# Altium schematic sheet 1_INDEX.SchDoc
size 420 x 297 mm; SheetNumber: 1; SheetTotal: 7; Sub-system: LDA
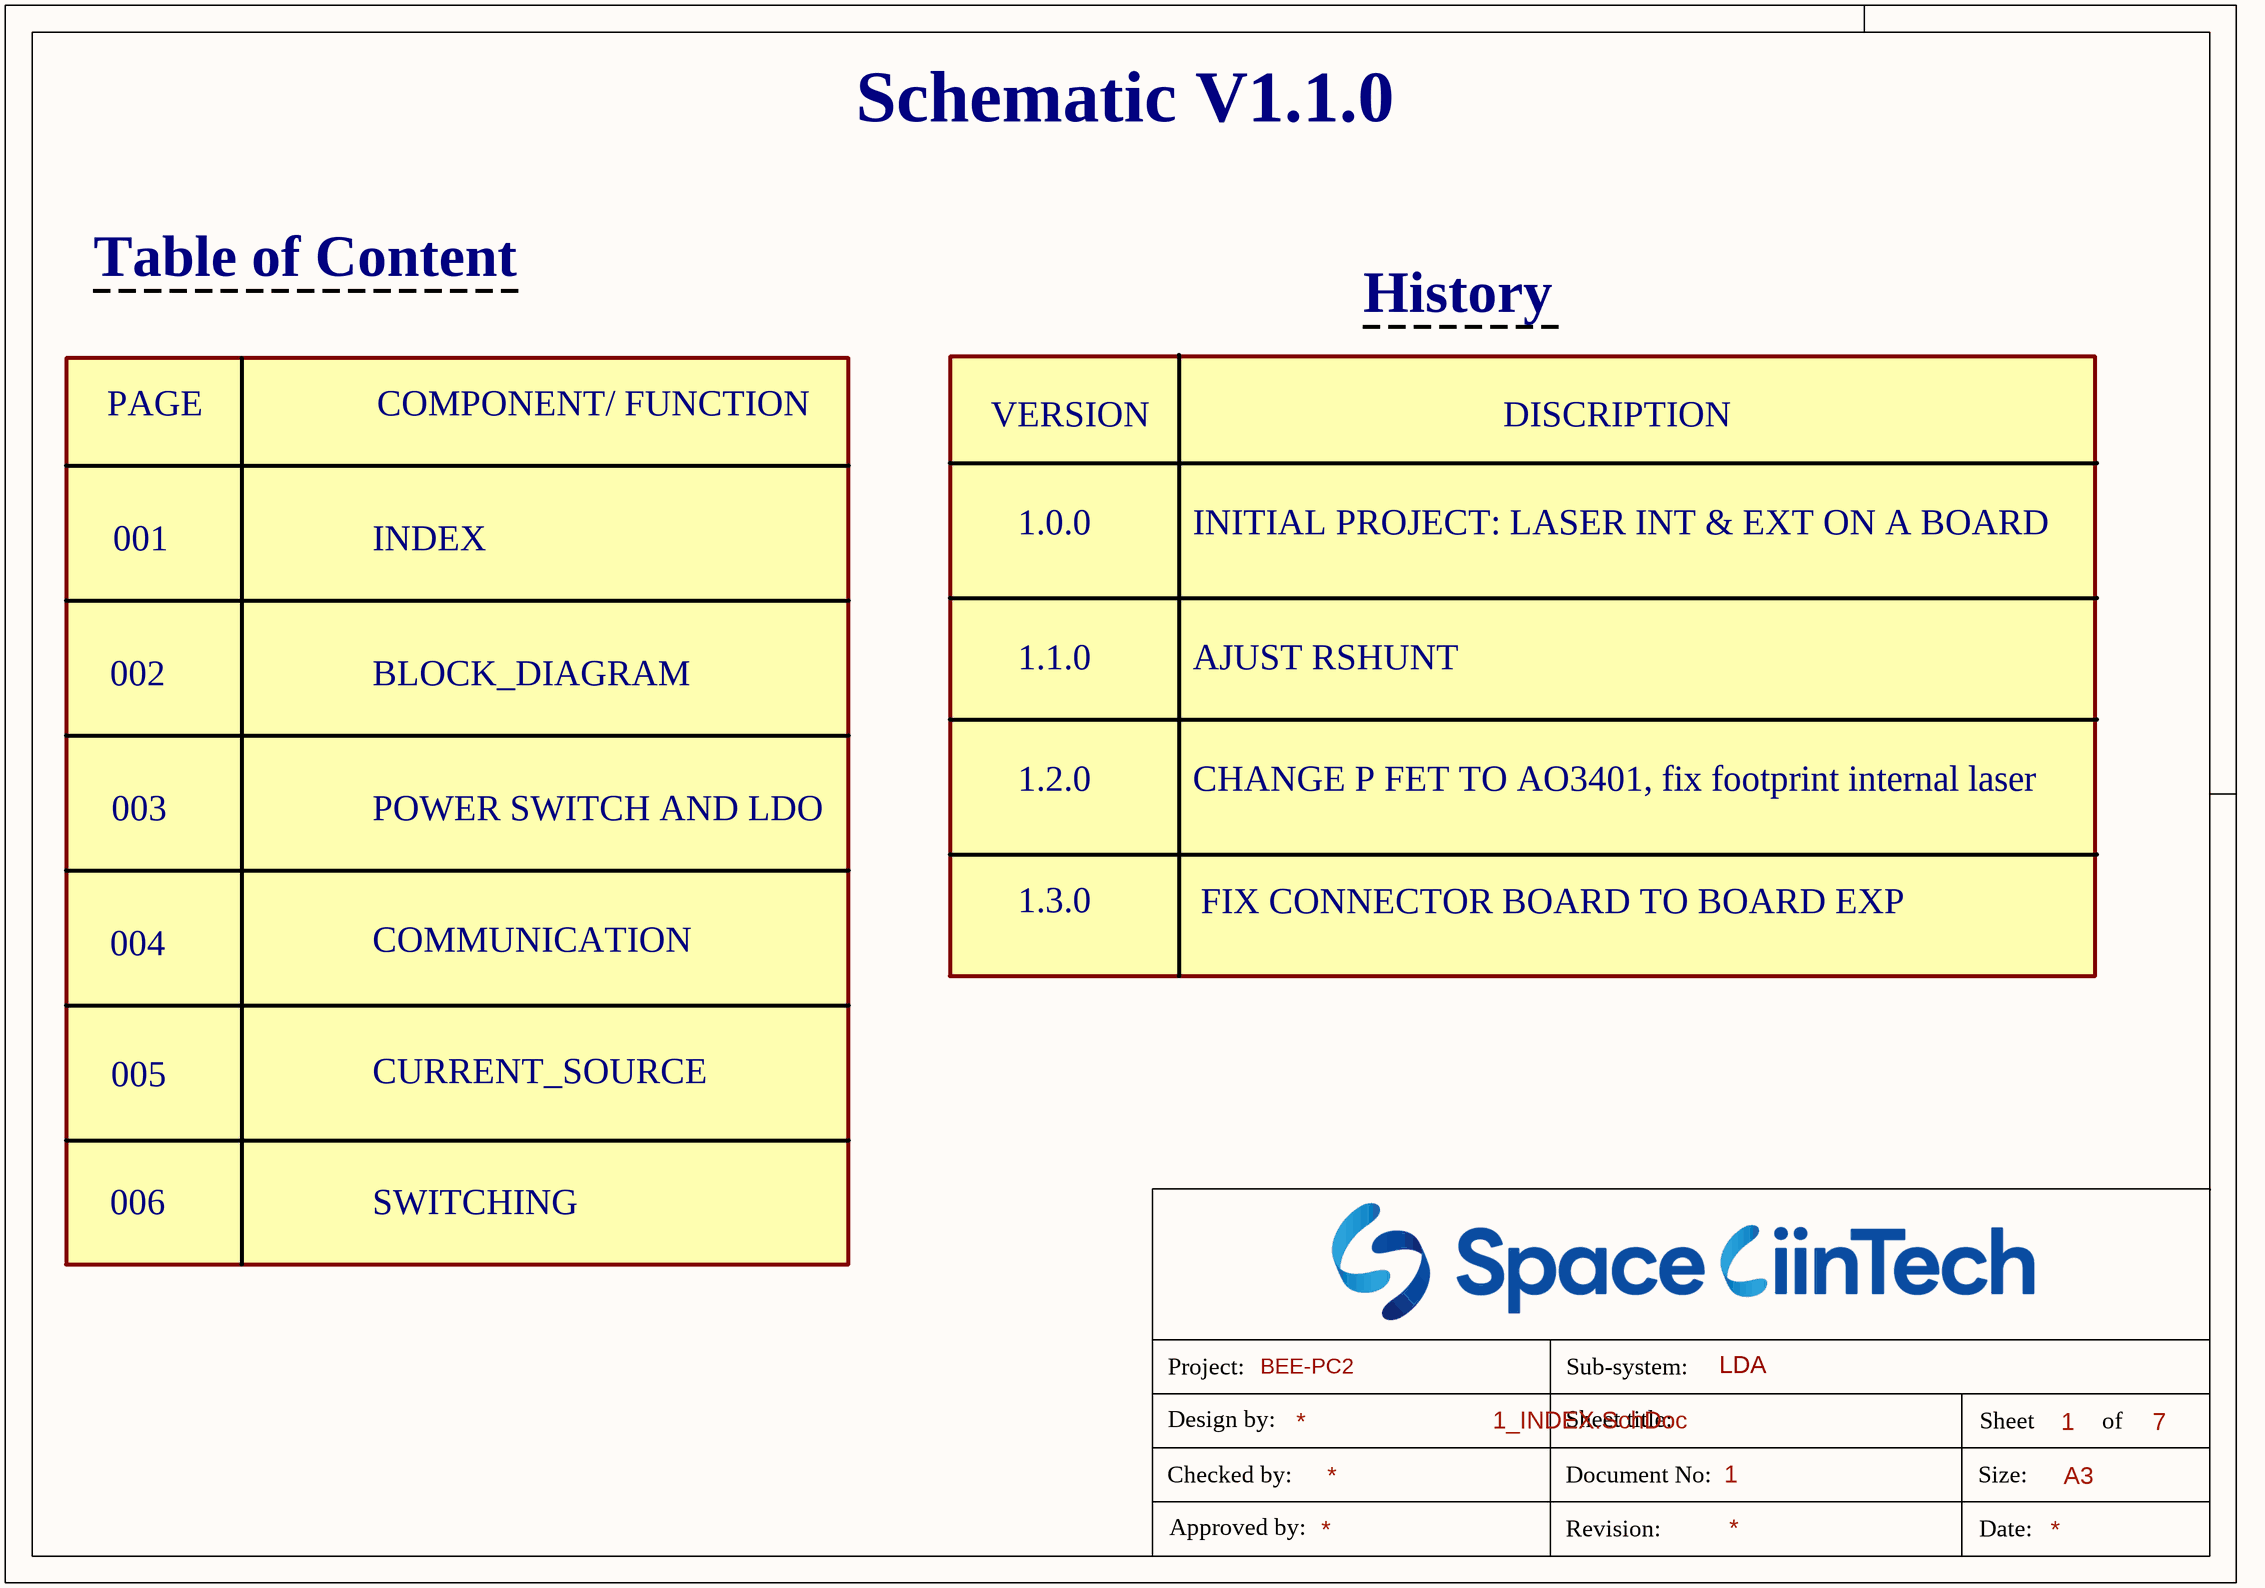
[diagram p0: 1_INDEX.SchDoc]

## Notes on the sheet
- Schematic V1.1.0
- Table of Content
- History
- PAGE
- COMPONENT/ FUNCTION
- VERSION
- DISCRIPTION
- 001
- INDEX
- 1.0.0
- INITIAL PROJECT: LASER INT & EXT ON A BOARD
- 002
- BLOCK_DIAGRAM
- 1.1.0
- AJUST RSHUNT
- 1.2.0
- CHANGE P FET TO AO3401, fix footprint internal laser
- 003
- POWER SWITCH AND LDO
- 1.3.0
- FIX CONNECTOR BOARD TO BOARD EXP
- 004
- COMMUNICATION
- 005
- CURRENT_SOURCE
- 006
- SWITCHING
- BEE-PC2
- Project:
- Sub-system:
- Design by:
- Sheet title:
- Sheet
- A3
- of
- Checked by:
- Approved by:
- Revision:
- Document No:
- Size:
- Date: